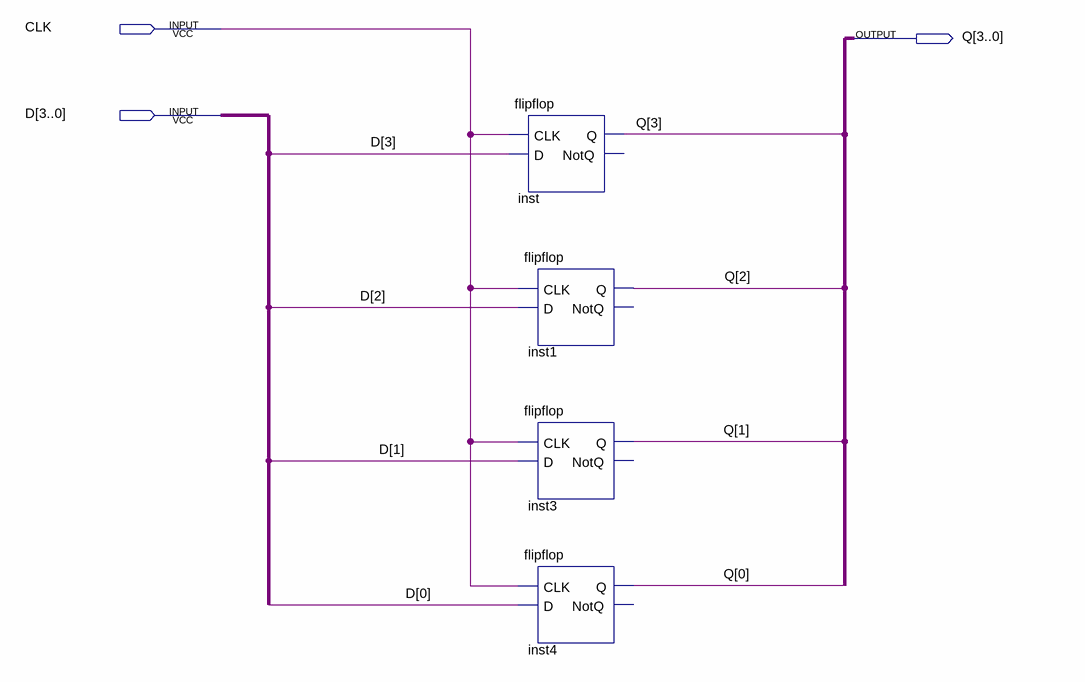
[diagram p0: schematic sheet]
// Quartus schematic nonresttablefourbitregister.bdf as structural Verilog: 4 symbols, 3 pins
module nonresttablefourbitregister (
  input  CLK,
  input  [3:0] D,
  output [3:0] Q
);

  flipflop inst (.CLK(CLK), .D(D[3]), .Q(Q[3]));  // open: NotQ
  flipflop inst1 (.CLK(CLK), .D(D[2]), .Q(Q[2]));  // open: NotQ
  flipflop inst3 (.CLK(CLK), .D(D[1]), .Q(Q[1]));  // open: NotQ
  flipflop inst4 (.CLK(CLK), .D(D[0]), .Q(Q[0]));  // open: NotQ
endmodule
